# Altium schematic sheet PWR_SW_AND_VI_SENSE.SchDoc
size B; SheetNumber: 16; SheetTotal: 21
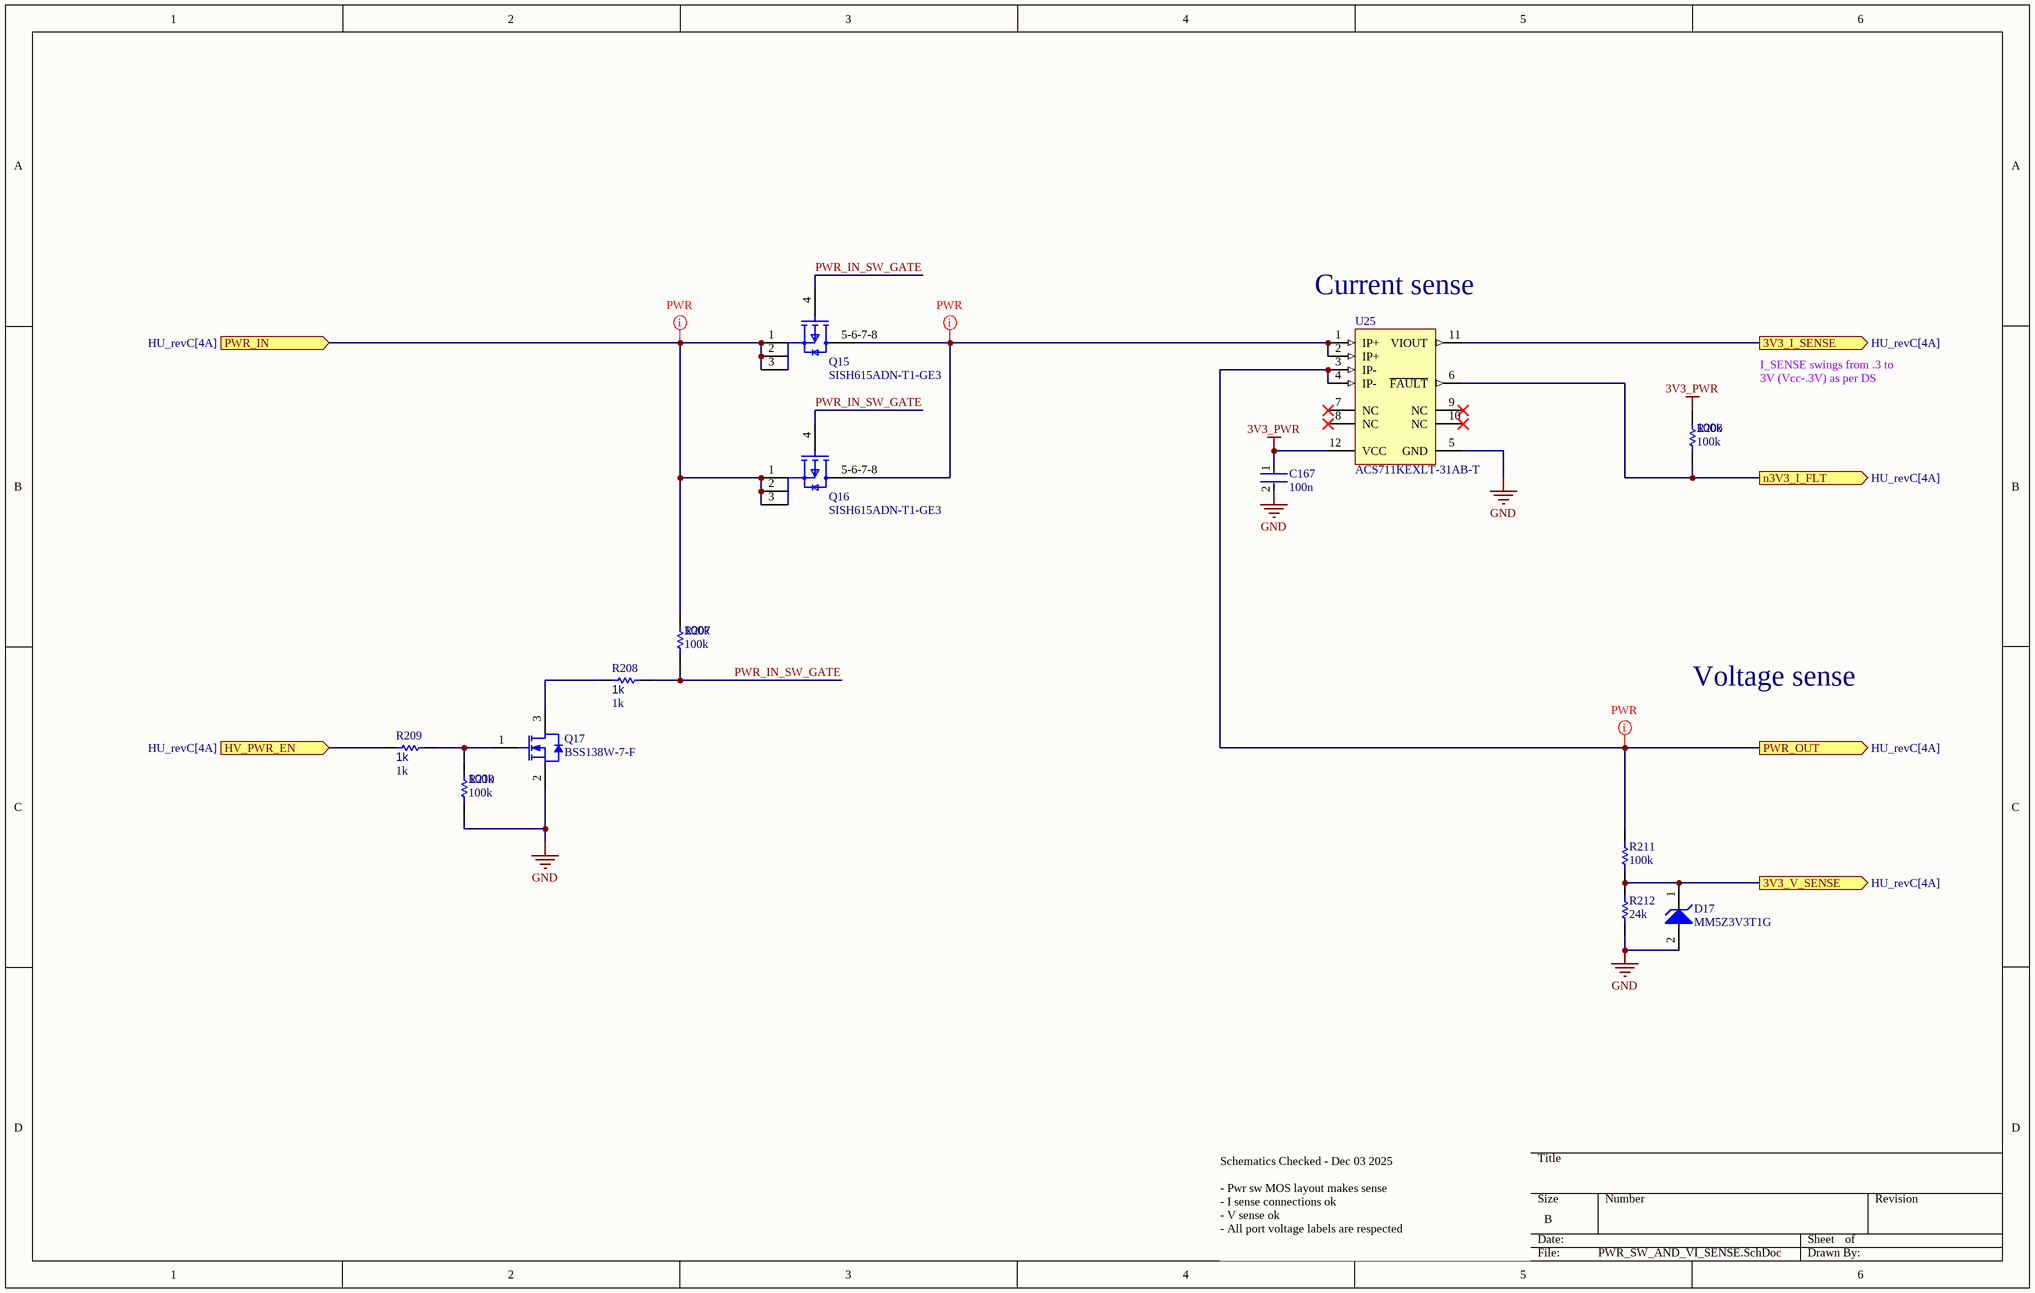
[diagram p0: PWR_SW_AND_VI_SENSE.SchDoc]

## Parts
C167  100n  [FP-0402-L_1_0_0_05-W_0_5-IPC_A]
D17  MM5Z3V3T1G  [ONSC-SOD-523-2-502-01_V]
Q15  SISH615ADN-T1-GE3  [SISH615ADN-T1-GE3-Footprint-1]
Q16  SISH615ADN-T1-GE3  [SISH615ADN-T1-GE3-Footprint-1]
Q17  BSS138W-7-F  [DIOD-SOT323-3_V]
R206  100k  [R0603B]
R207  100k  [R0603B]
R208  1k  [R0603B]
R209  1k  [R0603B]
R210  100k  [R0603B]
R211  100k  [R0603B]
R212  24k  [R0603B]
U25  ACS711KEXLT-31AB-T  [ALEG-EX-12_V]

## Ports
3V3_I_SENSE (out, see HU_revC[4A]), 3V3_V_SENSE (out, see HU_revC[4A]), HV_PWR_EN (in, see HU_revC[4A]), n3V3_I_FLT (out, see HU_revC[4A]), PWR_IN (in, see HU_revC[4A]), PWR_OUT (out, see HU_revC[4A])

## Nets
3V3_PWR: C167.1 R206.2 U25.12(VCC)
GND: C167.2 D17.2(A) Q17.2(S) R210.1 R212.1 U25.5(GND)
3V3_I_SENSE: U25.11(VIOUT) ; port 3V3_I_SENSE
3V3_V_SENSE: D17.1(K) R211.1 R212.2 ; port 3V3_V_SENSE
HV_PWR_EN: R209.1 ; port HV_PWR_EN
n3V3_I_FLT: R206.1 U25.6(~{FAULT}) ; port n3V3_I_FLT
PWR_IN: Q15.1(S) Q15.2(S) Q15.3(S) Q16.1(S) Q16.2(S) Q16.3(S) R207.2 ; port PWR_IN
PWR_IN_SW_GATE: Q15.4(G) Q16.4(G) R207.1 R208.2
PWR_OUT: R211.2 U25.3(IP-) U25.4(IP-) ; port PWR_OUT
NetQ15_5-6-7-8: Q15.5-6-7-8(D) Q16.5-6-7-8(D) U25.1(IP+) U25.2(IP+)
NetQ17_1: Q17.1(G) R209.2 R210.2
NetQ17_3: Q17.3(D) R208.1

Not connected (* = marked no-connect by the designer): U25 7(NC)* 8(NC)* 9(NC)* 10(NC)*

## Layout directives
net class PWR: NetQ15_5-6-7-8, PWR_IN, PWR_OUT

## Notes on the sheet
- (near U25) Current sense
- I_SENSE swings from .3 to 3V (Vcc-.3V) as per DS
- Voltage sense
- Schematics Checked - Dec 03 2025
  - Pwr sw MOS layout makes sense
  - I sense connections ok
  - V sense ok
  - All port voltage labels are respected

## Library data of the parts
C167 = CMP-001-00058-1: LARGE PADS, 0402 CAP, CHANGE COMMENT TO MATCH REAL P/N; Capacitor Type: Ceramic; Min Operating Temperature: -55°C; Mounting Technology: Surface Mount; Pins: 2; Case/Package: 0402; RoHS Compliant: Yes; Max Operating Temperature: 85°C
D17 = CMP-1060-00750-1: Zener Voltage Regulator, 500 mW, 2-Pin SOD-523, Pb-Free, Tape and Reel; Manufacturer: On Semiconductor; P Max (W): 0.5; VZ Typ (V): 3.3; RoHS: Pb-Free; ComponentLink2Description: Datasheet; PackageReference: SOD-523-2-502-01; DatasheetVersion: Rev. 10; ComponentLink1Description: Manufacturer URL; PackageVersion: Rev. E, 09/2010; ComponentLink3URL: http://www.onsemi.com/pub_link/Collateral/502-01.PDF; ComponentLink2URL: http://www.onsemi.cn/pub_link/Collateral/MM5Z2V4T1-D.PDF; Mounting Technology: Surface Mount; PartNumber: MM5Z3V3T1G; Packing: Tape and Reel; PackageDescription: 2-Pin SOD, Body 1.2 x 0.8 mm; ComponentLink1URL: http://www.onsemi.com/; ComponentLink3Description: Package Specification
Q15 Q16 = CMP-013-00018-2: Trans MOSFET P-CH 20V 22.1A 8-Pin PowerPAK 1212 EP T/R; Source: SISH615ADN-T1-GE3.SchLib; Design Item ID: CMP-013-00036-4; Component Type: Standard; Pins: 5
Q17 = CMP-2000-05968-1: N-Channel Enhancement Mode Mosfet, 50 V, 200 mA, -55 to 150 degC, 6-Pin SOT-323, RoHS, Tape and Reel; Typical Turn-Off Delay Time: 20ns; Number of Channels: 1Channel; Type: EnhancementModeFieldEffectTransistor; Brand: DiodesIncorporated; Vds - Drain-Source Breakdown Voltage: 75V; Vgs - Gate-Source Voltage: 20V; Rds On - Drain-Source Resistance: 1.4Ohms; Transistor Type: 1N-Channel; Configuration: Single; Unit Weight: 0.000212oz; Pd - Power Dissipation: 200mW; Id - Continuous Drain Current: 200mA; Forward Transconductance - Min: 0.1S; Manufacturer URL: http://www.diodes.com/; Series: BSS138; Package Description: 3-Pin Small Outline Transistor, Body 2 x 1.25 mm, Pitch 0.65 mm; Mounting Technology: SurfaceMount; Product Category: MOSFET; RoHS: True; Maximum Operating Temperature: +150C; Height: 1mm; Length: 2.2mm; Technology: Si; Width: 1.35mm; Datasheet URL: http://www.diodes.com/_files/datasheets/ds30206.pdf; Manufacturer: DiodesIncorporated; Package / Case: SOT-323-3; Typical Turn-On Delay Time: 20ns; Transistor Polarity: N-Channel; Factory Pack Quantity: 3000; Packaging: Reel; Product: MOSFETSmallSignal; Datasheet Version: Rev. 11-2, 09/2013; Package Reference: SOT323; Minimum Operating Temperature: -55C; Mounting Style: SMD/SMT; Channel Mode: Enhancement
R206-R212 = CMP-009-00002-14: Resistor
  R206 R207 R210 R211: Value: 100k
  R208 R209: Value: 1k
  R212: Value: 24k
U25 = CMP-1557-00002-1: Hall Effect Linear Current Sensor with Overcurrent Fault Output for <100 V Isolation Applications, 3 to 5.5 V, -31 to 31 A IP, -40 to 125 degC, 12-Pin QFN (EX), RoHS, Tape and Reel; IP Max: 31 A; VCC Min: 3 V; -3dB Bandwidth: 0.1 MHz; VCC Max: 5.5 V; IP Min: -31 A; Mounting Technology: Surface Mount; DatasheetVersion: Rev. 3; Temperature Min: -40 degC; ComponentLink1Description: Manufacturer URL; Packing: Tape and Reel; PartNumber: ACS711KEXLT-31AB-T; Temperature Max: 125 degC; ComponentLink2Description: Datasheet; ComponentLink3Description: Package Specification; RoHS: TRUE; ComponentLink1URL: http://www.allegromicro.com/; ComponentLink2URL: http://www.allegromicro.com/~/media/Files/Datasheets/ACS711-Datasheet.ashx?la=en; PackageDescription: 12-Pin Quad Flat No-Lead, Body 3 x 3 mm, Height 0.8 mm; ComponentLink3URL: http://www.allegromicro.com/~/media/Files/Datasheets/ACS711-Datasheet.ashx?la=en